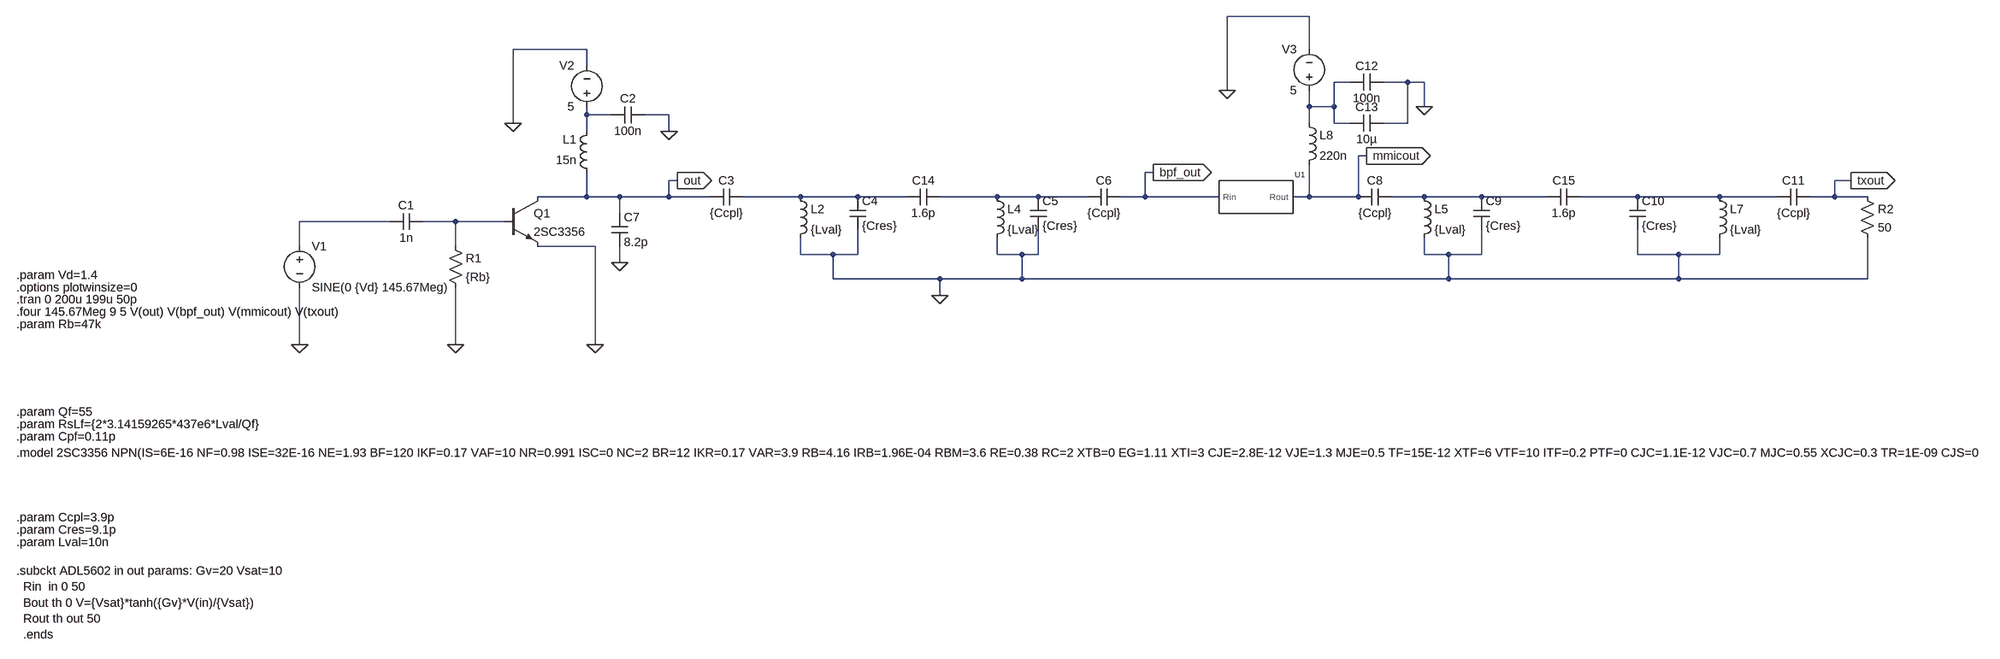
[diagram p0: schematic tx_circuit_cheby.asc]
tx_circuit_cheby.asc, the LTspice schematic file:
Version 4.1
SHEET 1 3716 968
WIRE 1856 -304 1696 -304
WIRE 448 -240 304 -240
WIRE 1856 -240 1856 -304
WIRE 448 -208 448 -240
WIRE 1936 -176 1904 -176
WIRE 2048 -176 2000 -176
WIRE 2080 -176 2048 -176
WIRE 1696 -160 1696 -304
WIRE 1856 -128 1856 -160
WIRE 1904 -128 1904 -176
WIRE 1904 -128 1856 -128
WIRE 2080 -128 2080 -176
WIRE 448 -112 448 -128
WIRE 496 -112 448 -112
WIRE 608 -112 560 -112
WIRE 304 -96 304 -240
WIRE 1856 -96 1856 -128
WIRE 1904 -96 1904 -128
WIRE 1936 -96 1904 -96
WIRE 2048 -96 2048 -176
WIRE 2048 -96 2000 -96
WIRE 448 -80 448 -112
WIRE 608 -80 608 -112
WIRE 1968 -32 1952 -32
WIRE 1552 0 1536 0
WIRE 624 16 608 16
WIRE 2912 16 2880 16
WIRE 448 48 448 0
WIRE 448 48 352 48
WIRE 512 48 448 48
WIRE 608 48 608 16
WIRE 608 48 512 48
WIRE 688 48 608 48
WIRE 864 48 752 48
WIRE 976 48 864 48
WIRE 1072 48 976 48
WIRE 1248 48 1136 48
WIRE 1328 48 1248 48
WIRE 1424 48 1328 48
WIRE 1536 48 1536 0
WIRE 1536 48 1488 48
WIRE 1680 48 1536 48
WIRE 1856 48 1856 -16
WIRE 1856 48 1824 48
WIRE 1952 48 1952 -32
WIRE 1952 48 1856 48
WIRE 2080 48 2016 48
WIRE 2192 48 2080 48
WIRE 2320 48 2192 48
WIRE 2496 48 2384 48
WIRE 2656 48 2496 48
WIRE 2768 48 2656 48
WIRE 2880 48 2880 16
WIRE 2880 48 2832 48
WIRE 2944 48 2880 48
WIRE 512 80 512 48
WIRE 64 96 -112 96
WIRE 192 96 128 96
WIRE 288 96 192 96
WIRE -112 144 -112 96
WIRE 192 144 192 96
WIRE 464 144 352 144
WIRE 864 160 864 128
WIRE 928 160 864 160
WIRE 976 160 976 112
WIRE 976 160 928 160
WIRE 1248 160 1248 128
WIRE 1296 160 1248 160
WIRE 1328 160 1328 112
WIRE 1328 160 1296 160
WIRE 2080 160 2080 128
WIRE 2128 160 2080 160
WIRE 2192 160 2192 112
WIRE 2192 160 2128 160
WIRE 2496 160 2496 112
WIRE 2576 160 2496 160
WIRE 2656 160 2656 128
WIRE 2656 160 2576 160
WIRE 512 176 512 144
WIRE 928 208 928 160
WIRE 1136 208 928 208
WIRE 1296 208 1296 160
WIRE 1296 208 1136 208
WIRE 2128 208 2128 160
WIRE 2128 208 1296 208
WIRE 2576 208 2576 160
WIRE 2576 208 2128 208
WIRE 2944 208 2944 128
WIRE 2944 208 2576 208
WIRE 1136 240 1136 208
WIRE -112 336 -112 224
WIRE 192 336 192 224
WIRE 464 336 464 144
FLAG 192 336 0
FLAG -112 336 0
FLAG 464 336 0
FLAG 304 -96 0
FLAG 608 -80 0
FLAG 1136 240 0
FLAG 1552 0 bpf_out
IOPIN 1552 0 Out
FLAG 624 16 out
IOPIN 624 16 Out
FLAG 512 176 0
FLAG 1968 -32 mmicout
IOPIN 1968 -32 Out
FLAG 2912 16 txout
IOPIN 2912 16 Out
FLAG 1696 -160 0
FLAG 2080 -128 0
SYMBOL voltage -112 128 R0
WINDOW 123 0 0 Left 0
WINDOW 39 0 0 Left 0
SYMATTR InstName V1
SYMATTR Value SINE(0 {Vd} 145.67Meg)
SYMBOL npn 288 48 R0
SYMATTR InstName Q1
SYMATTR Value 2SC3356
SYMBOL cap 128 80 R90
WINDOW 0 0 32 VBottom 2
WINDOW 3 32 32 VTop 2
SYMATTR InstName C1
SYMATTR Value 1n
SYMBOL cap 560 -128 R90
WINDOW 0 0 32 VBottom 2
WINDOW 3 32 32 VTop 2
SYMATTR InstName C2
SYMATTR Value 100n
SYMBOL ind 464 16 R180
WINDOW 0 36 80 Left 2
WINDOW 3 36 40 Left 2
SYMATTR InstName L1
SYMATTR Value 15n
SYMATTR SpiceLine Rser=0.3
SYMBOL res 176 128 R0
SYMATTR InstName R1
SYMATTR Value {Rb}
SYMBOL voltage 448 -112 R180
WINDOW 0 24 96 Left 2
WINDOW 3 24 16 Left 2
WINDOW 123 0 0 Left 0
WINDOW 39 0 0 Left 0
SYMATTR InstName V2
SYMATTR Value 5
SYMBOL cap 752 32 R90
WINDOW 0 0 32 VBottom 2
WINDOW 3 32 32 VTop 2
SYMATTR InstName C3
SYMATTR Value {Ccpl}
SYMBOL ind 848 32 R0
SYMATTR InstName L2
SYMATTR Value {Lval}
SYMATTR SpiceLine Rser={RsLf} Cpar={Cpf}
SYMBOL cap 960 48 R0
SYMATTR InstName C4
SYMATTR Value {Cres}
SYMBOL cap 1488 32 R90
WINDOW 0 0 32 VBottom 2
WINDOW 3 32 32 VTop 2
SYMATTR InstName C6
SYMATTR Value {Ccpl}
SYMBOL ind 1232 32 R0
SYMATTR InstName L4
SYMATTR Value {Lval}
SYMATTR SpiceLine Rser={RsLf} Cpar={Cpf}
SYMBOL cap 1312 48 R0
SYMATTR InstName C5
SYMATTR Value {Cres}
SYMBOL cap 496 80 R0
SYMATTR InstName C7
SYMATTR Value 8.2p
SYMBOL ADL5602 1744 48 R0
SYMATTR InstName U1
SYMBOL cap 2016 32 R90
WINDOW 0 0 32 VBottom 2
WINDOW 3 32 32 VTop 2
SYMATTR InstName C8
SYMATTR Value {Ccpl}
SYMBOL ind 2064 32 R0
SYMATTR InstName L5
SYMATTR Value {Lval}
SYMATTR SpiceLine Rser=1m
SYMBOL cap 2176 48 R0
SYMATTR InstName C9
SYMATTR Value {Cres}
SYMBOL cap 2480 48 R0
SYMATTR InstName C10
SYMATTR Value {Cres}
SYMBOL ind 2640 32 R0
SYMATTR InstName L7
SYMATTR Value {Lval}
SYMATTR SpiceLine Rser=1m
SYMBOL cap 2832 32 R90
WINDOW 0 0 32 VBottom 2
WINDOW 3 32 32 VTop 2
SYMATTR InstName C11
SYMATTR Value {Ccpl}
SYMBOL res 2928 32 R0
SYMATTR InstName R2
SYMATTR Value 50
SYMBOL voltage 1856 -144 R180
WINDOW 0 24 96 Left 2
WINDOW 3 24 16 Left 2
WINDOW 123 0 0 Left 0
WINDOW 39 0 0 Left 0
SYMATTR InstName V3
SYMATTR Value 5
SYMBOL ind 1840 -112 R0
SYMATTR InstName L8
SYMATTR Value 220n
SYMATTR SpiceLine Rser=1m
SYMBOL cap 2000 -192 R90
WINDOW 0 0 32 VBottom 2
WINDOW 3 32 32 VTop 2
SYMATTR InstName C12
SYMATTR Value 100n
SYMBOL cap 2000 -112 R90
WINDOW 0 0 32 VBottom 2
WINDOW 3 32 32 VTop 2
SYMATTR InstName C13
SYMATTR Value 10µ
SYMBOL cap 1136 32 R90
WINDOW 0 0 32 VBottom 2
WINDOW 3 32 32 VTop 2
SYMATTR InstName C14
SYMATTR Value 1.6p
SYMBOL cap 2384 32 R90
WINDOW 0 0 32 VBottom 2
WINDOW 3 32 32 VTop 2
SYMATTR InstName C15
SYMATTR Value 1.6p
TEXT -664 248 Left 2 !.tran 0 200u 199u 50p
TEXT -664 224 Left 2 !.options plotwinsize=0
TEXT -664 272 Left 2 !.four 145.67Meg 9 5 V(out) V(bpf_out) V(mmicout) V(txout)
TEXT -664 200 Left 2 !.param Vd=1.4
TEXT -664 296 Left 2 !.param Rb=47k
TEXT -664 472 Left 2 !.param Qf=55
TEXT -664 496 Left 2 !.param RsLf={2*3.14159265*437e6*Lval/Qf}
TEXT -664 520 Left 2 !.param Cpf=0.11p
TEXT -664 736 Left 2 !.param Ccpl=3.9p
TEXT -664 760 Left 2 !.param Cres=9.1p
TEXT -664 784 Left 2 !.param Lval=10n
TEXT -664 552 Left 2 !.model 2SC3356 NPN(IS=6E-16 NF=0.98 ISE=32E-16 NE=1.93 BF=120 IKF=0.17 VAF=10 NR=0.991 ISC=0 NC=2 BR=12 IKR=0.17 VAR=3.9 RB=4.16 IRB=1.96E-04 RBM=3.6 RE=0.38 RC=2 XTB=0 EG=1.11 XTI=3 CJE=2.8E-12 VJE=1.3 MJE=0.5 TF=15E-12 XTF=6 VTF=10 ITF=0.2 PTF=0 CJC=1.1E-12 VJC=0.7 MJC=0.55 XCJC=0.3 TR=1E-09 CJS=0 VJS=0.75 MJS=0 FC=0.5)
TEXT -664 840 Left 2 !.subckt ADL5602 in out params: Gv=20 Vsat=10\n  Rin  in 0 50\n  Bout th 0 V={Vsat}*tanh({Gv}*V(in)/{Vsat})\n  Rout th out 50\n  .ends

The netlist it stands for:
* tx_circuit_cheby.asc
V1 N007 0 SINE(0 {Vd} 145.67Meg)
Q1 out N008 0 0 2SC3356
C1 N008 N007 1n
C2 0 N002 100n
L1 out N002 15n Rser=0.3
R1 N008 0 {Rb}
V2 N002 0 5
C3 N003 out {Ccpl}
L2 N003 0 {Lval} Rser={RsLf} Cpar={Cpf}
C4 N003 0 {Cres}
C6 bpf_out N004 {Ccpl}
L4 N004 0 {Lval} Rser={RsLf} Cpar={Cpf}
C5 N004 0 {Cres}
C7 out 0 8.2p
X§U1 bpf_out mmicout ADL5602  ; pins Rin Rout
C8 N005 mmicout {Ccpl}
L5 N005 0 {Lval} Rser=1m
C9 N005 0 {Cres}
C10 N006 0 {Cres}
L7 N006 0 {Lval} Rser=1m
C11 txout N006 {Ccpl}
R2 txout 0 50
V3 N001 0 5
L8 N001 mmicout 220n Rser=1m
C12 0 N001 100n
C13 0 N001 10µ
C14 N004 N003 1.6p
C15 N006 N005 1.6p
.model NPN NPN
.model PNP PNP
.lib standard.bjt
.tran 0 200u 199u 50p
.options plotwinsize=0
.four 145.67Meg 9 5 V(out) V(bpf_out) V(mmicout) V(txout)
.param Vd=1.4
.param Rb=47k
.param Qf=55
.param RsLf={2*3.14159265*437e6*Lval/Qf}
.param Cpf=0.11p
.param Ccpl=3.9p
.param Cres=9.1p
.param Lval=10n
.model 2SC3356 NPN(IS=6E-16 NF=0.98 ISE=32E-16 NE=1.93 BF=120 IKF=0.17 VAF=10 NR=0.991 ISC=0 NC=2 BR=12 IKR=0.17 VAR=3.9 RB=4.16 IRB=1.96E-04 RBM=3.6 RE=0.38 RC=2 XTB=0 EG=1.11 XTI=3 CJE=2.8E-12 VJE=1.3 MJE=0.5 TF=15E-12 XTF=6 VTF=10 ITF=0.2 PTF=0 CJC=1.1E-12 VJC=0.7 MJC=0.55 XCJC=0.3 TR=1E-09 CJS=0 VJS=0.75 MJS=0 FC=0.5)
.subckt ADL5602 in out params: Gv=20 Vsat=10
  Rin  in 0 50
  Bout th 0 V={Vsat}*tanh({Gv}*V(in)/{Vsat})
  Rout th out 50
  .ends
.backanno
.end